# Altium schematic sheet Power.SchDoc
size 840 x 594 mm
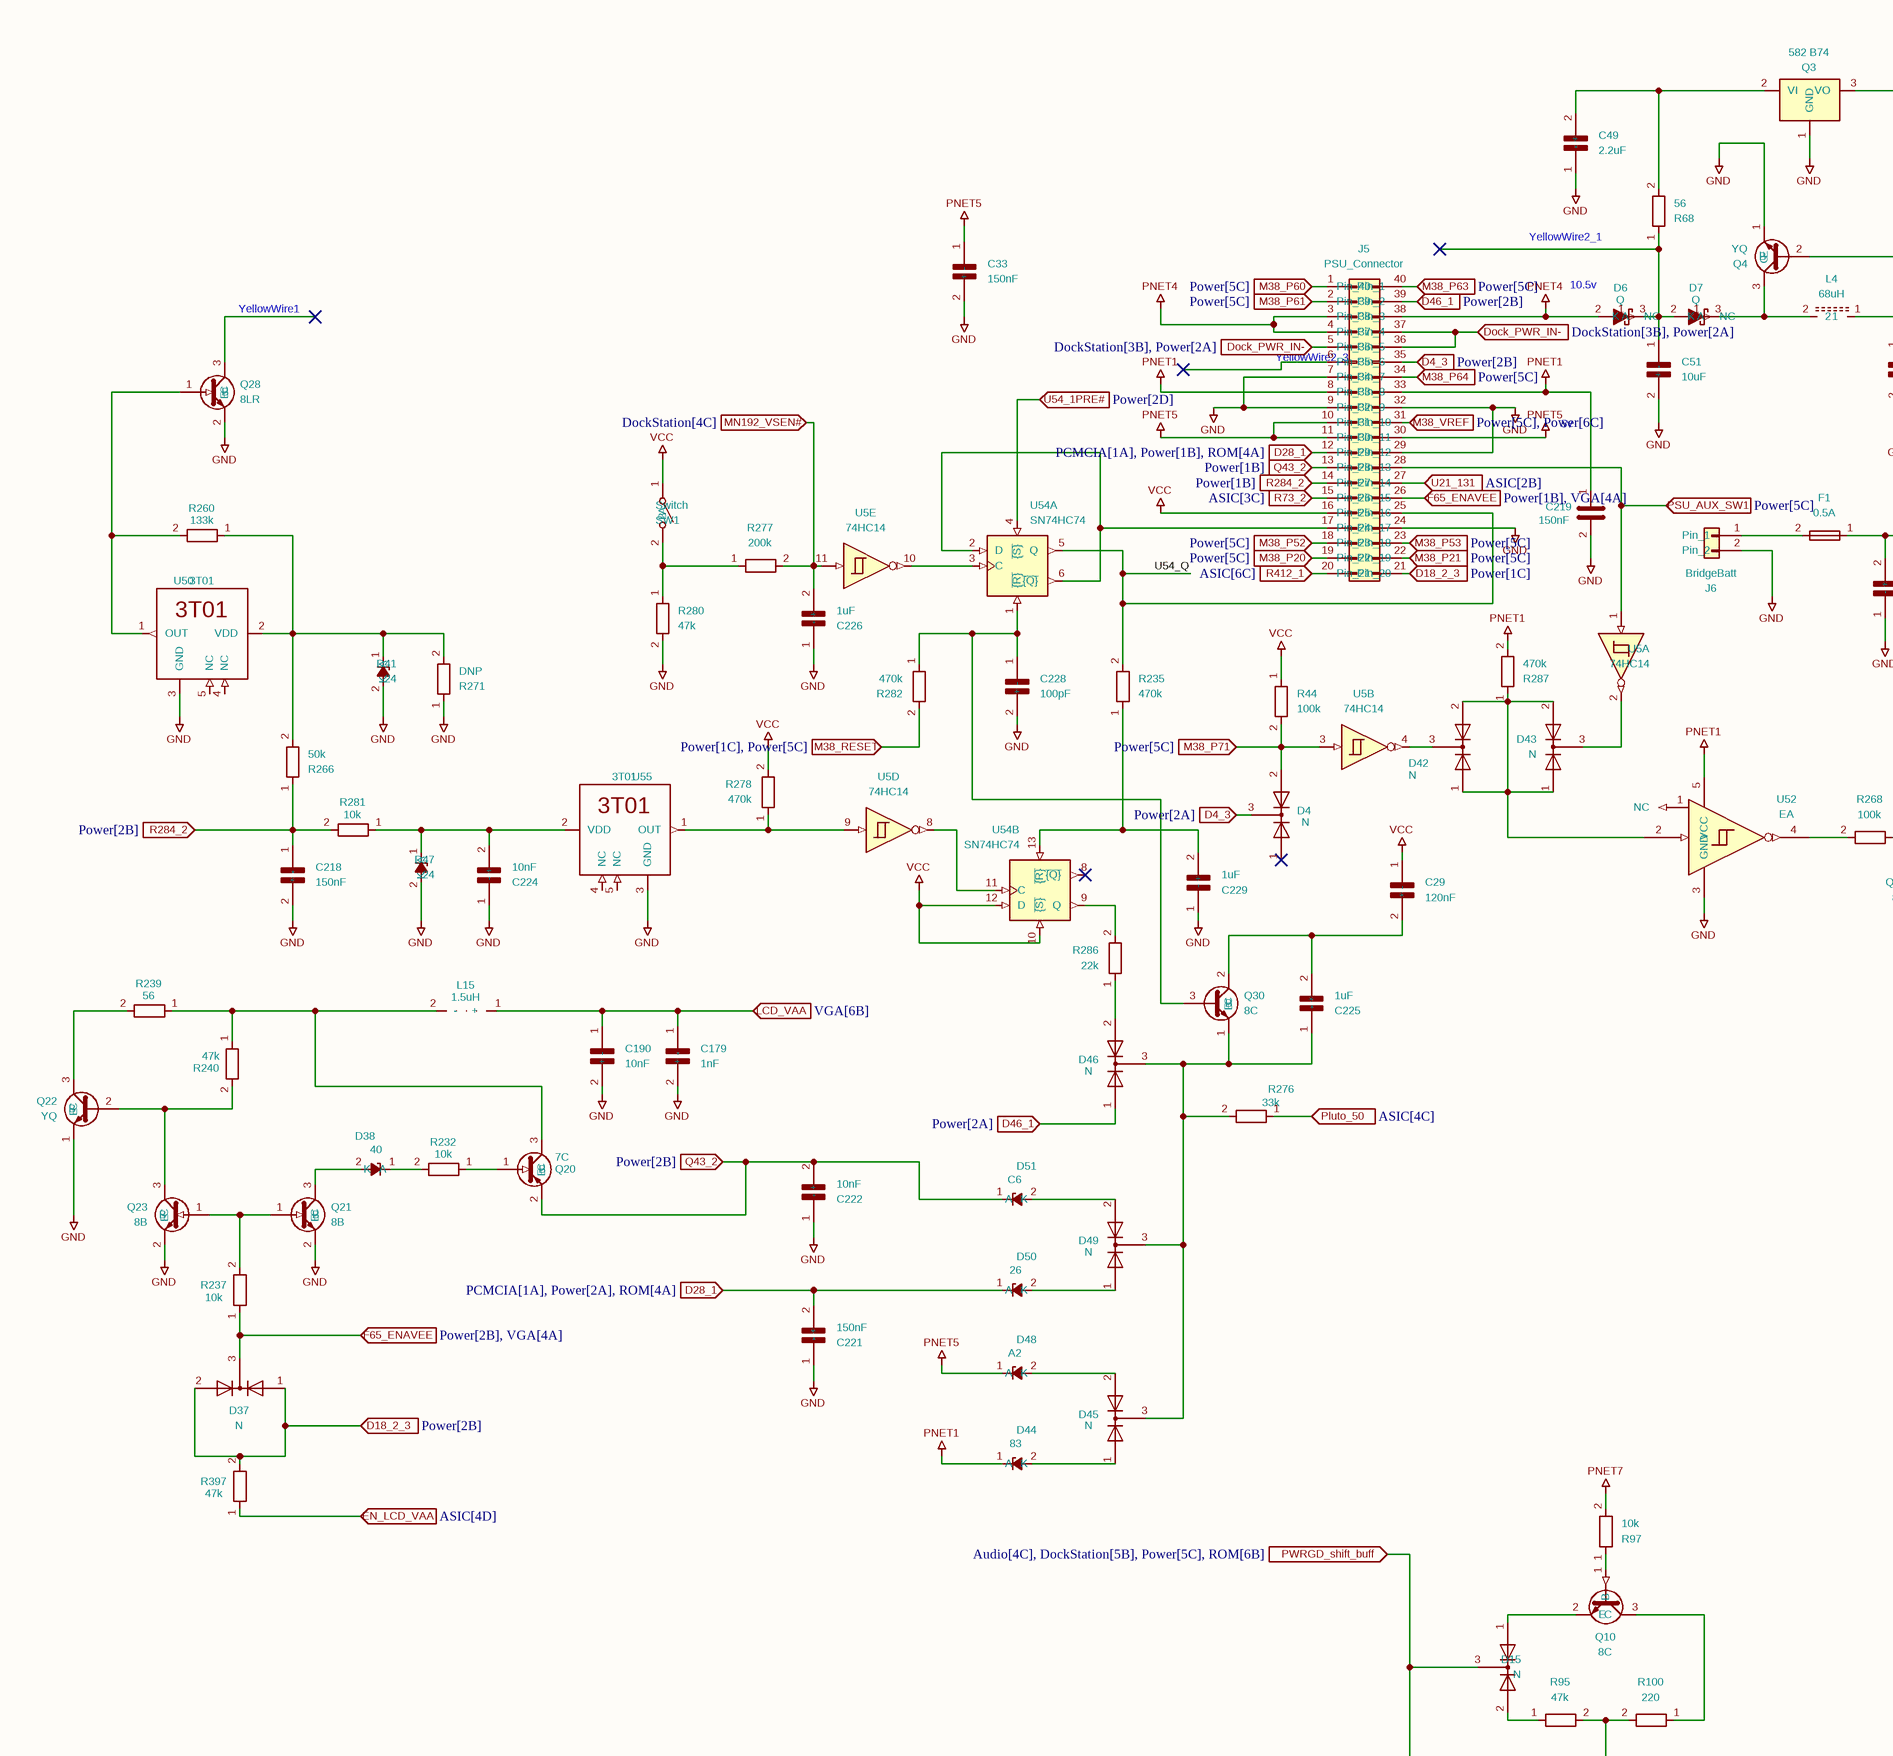
[diagram p0: Power.SchDoc, top left]
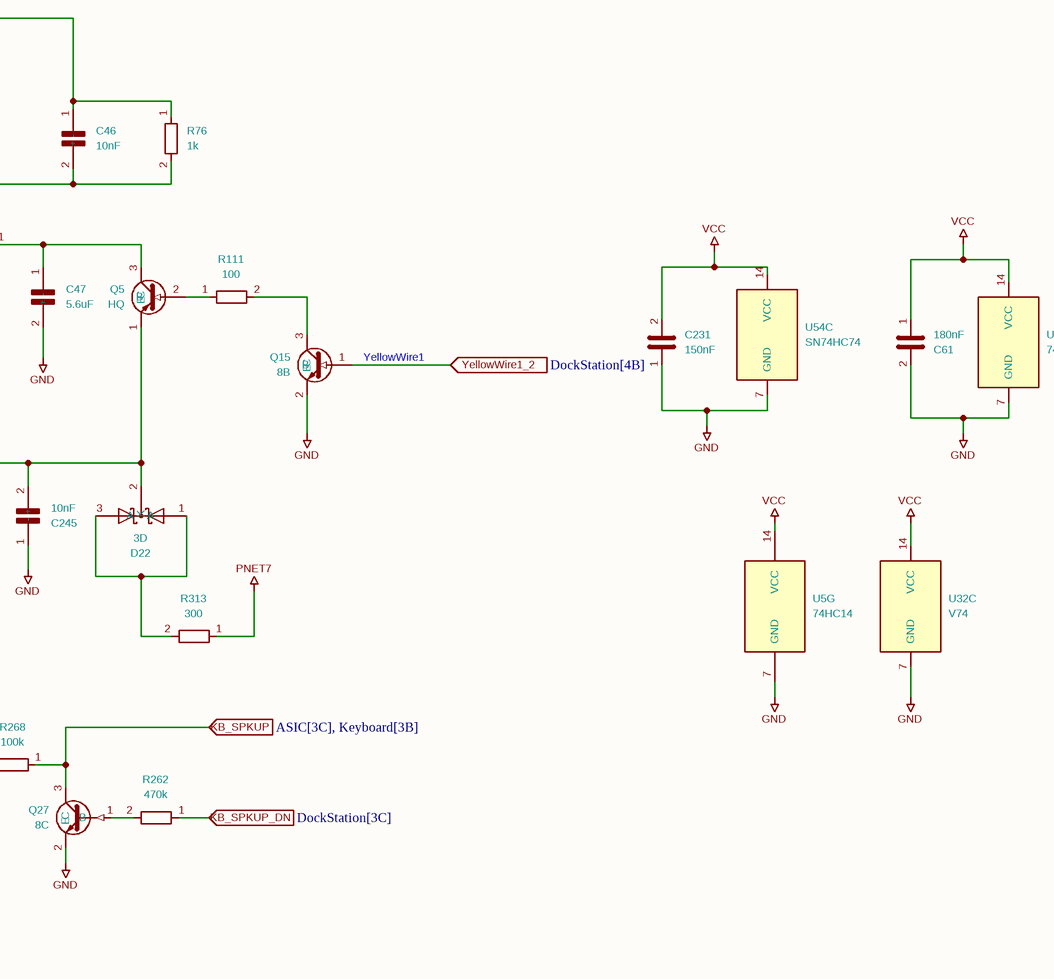
[diagram p1: Power.SchDoc, top middle]
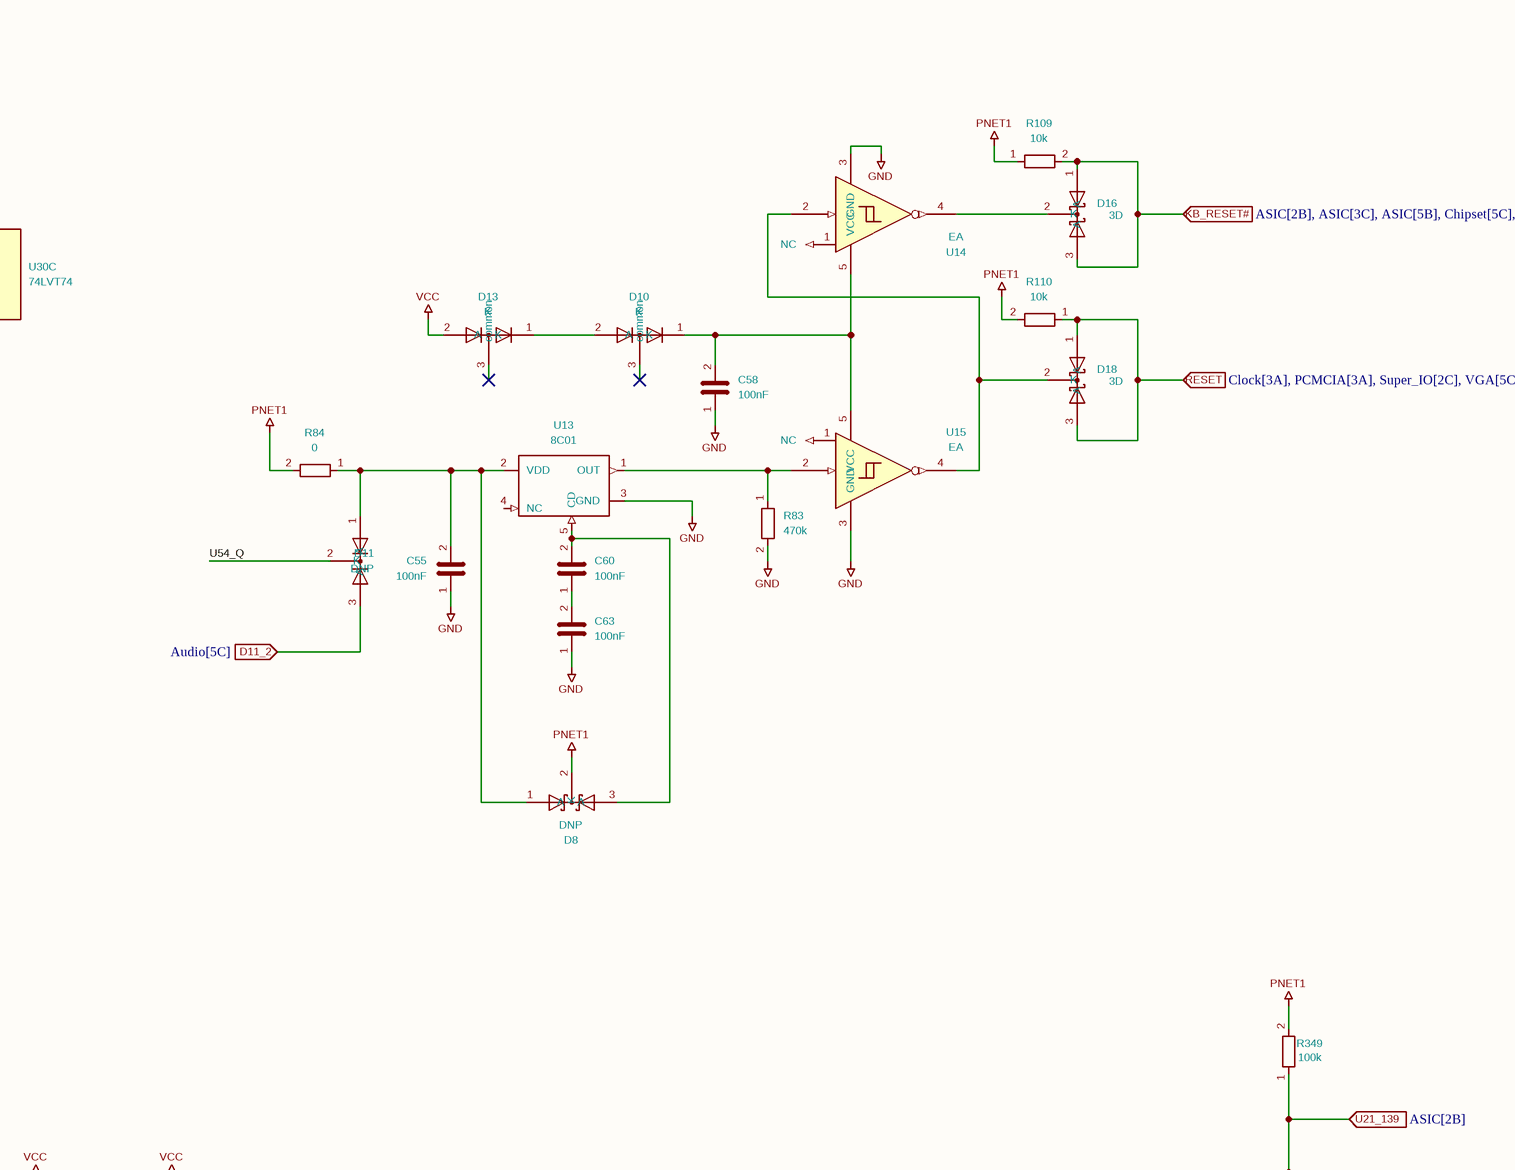
[diagram p2: Power.SchDoc, top right]
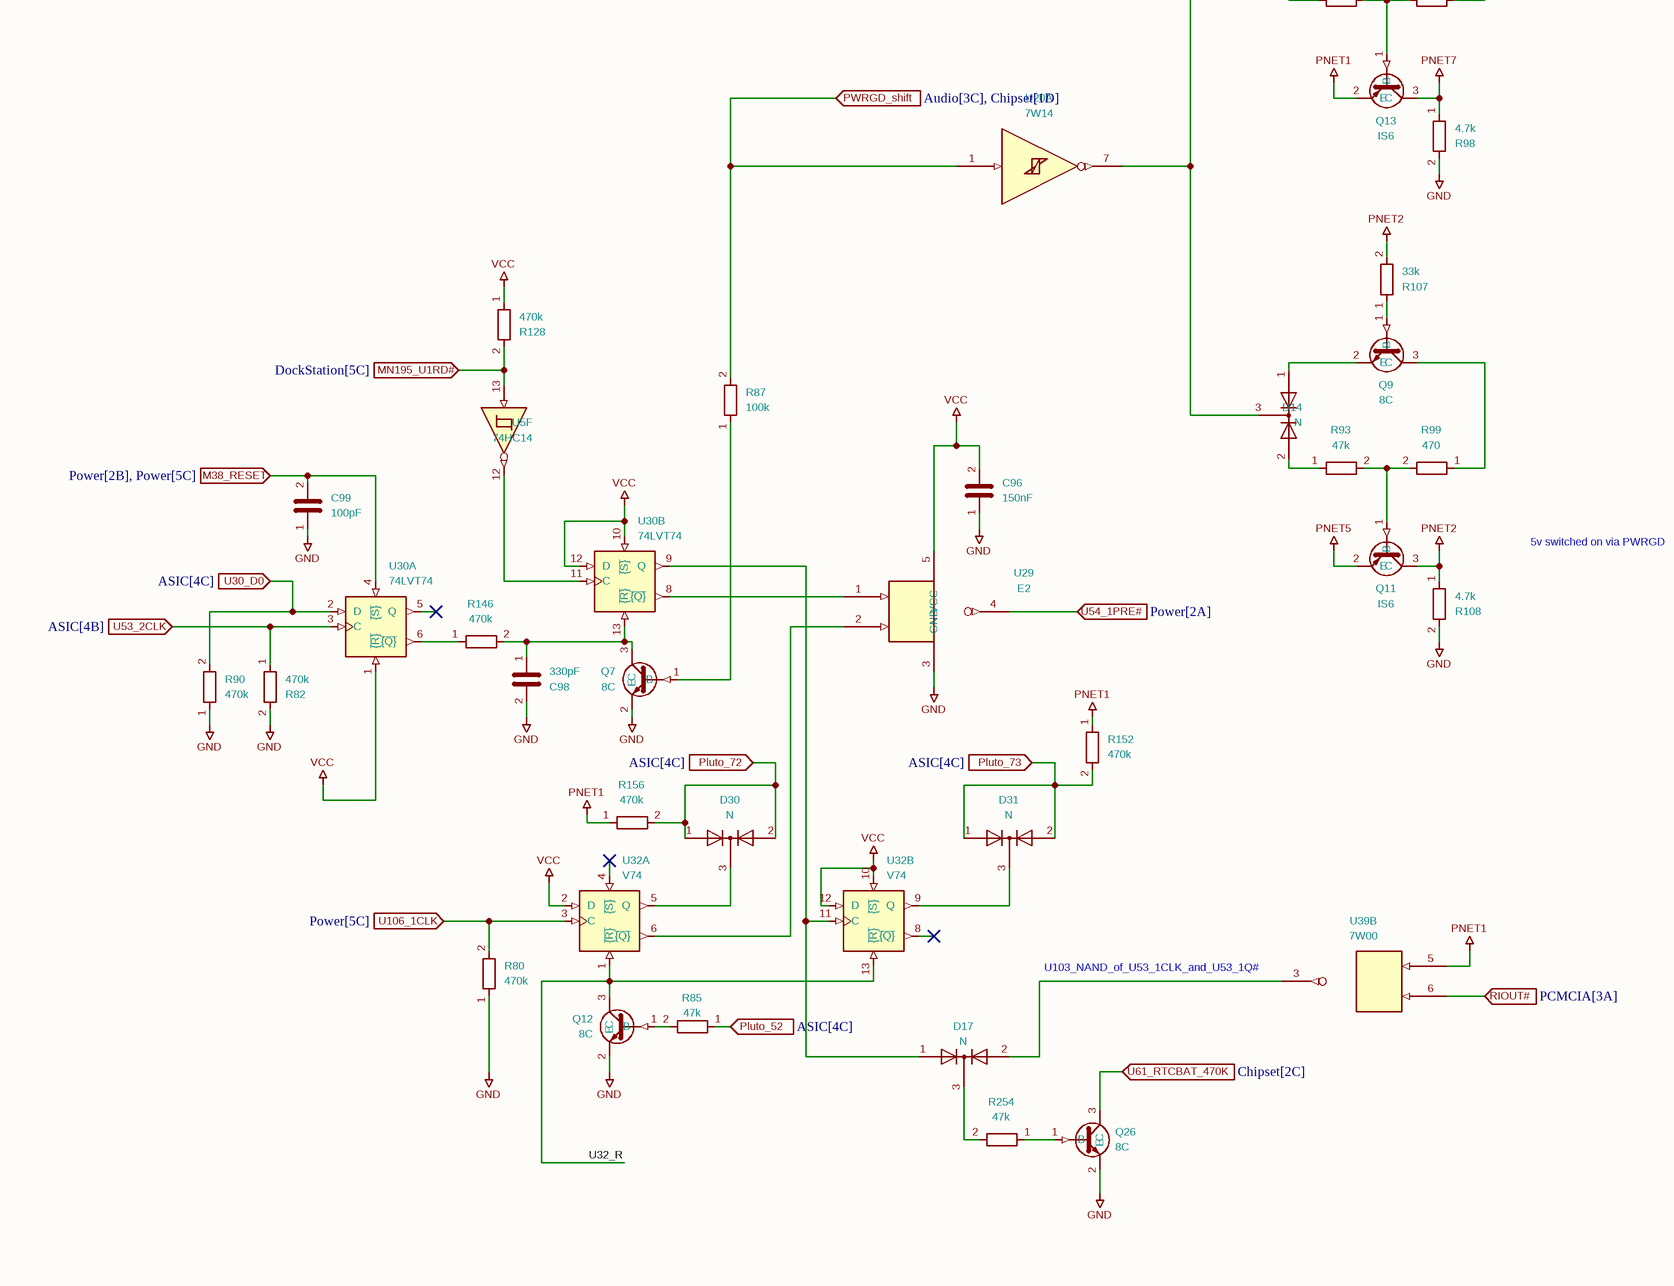
[diagram p3: Power.SchDoc, bottom left]
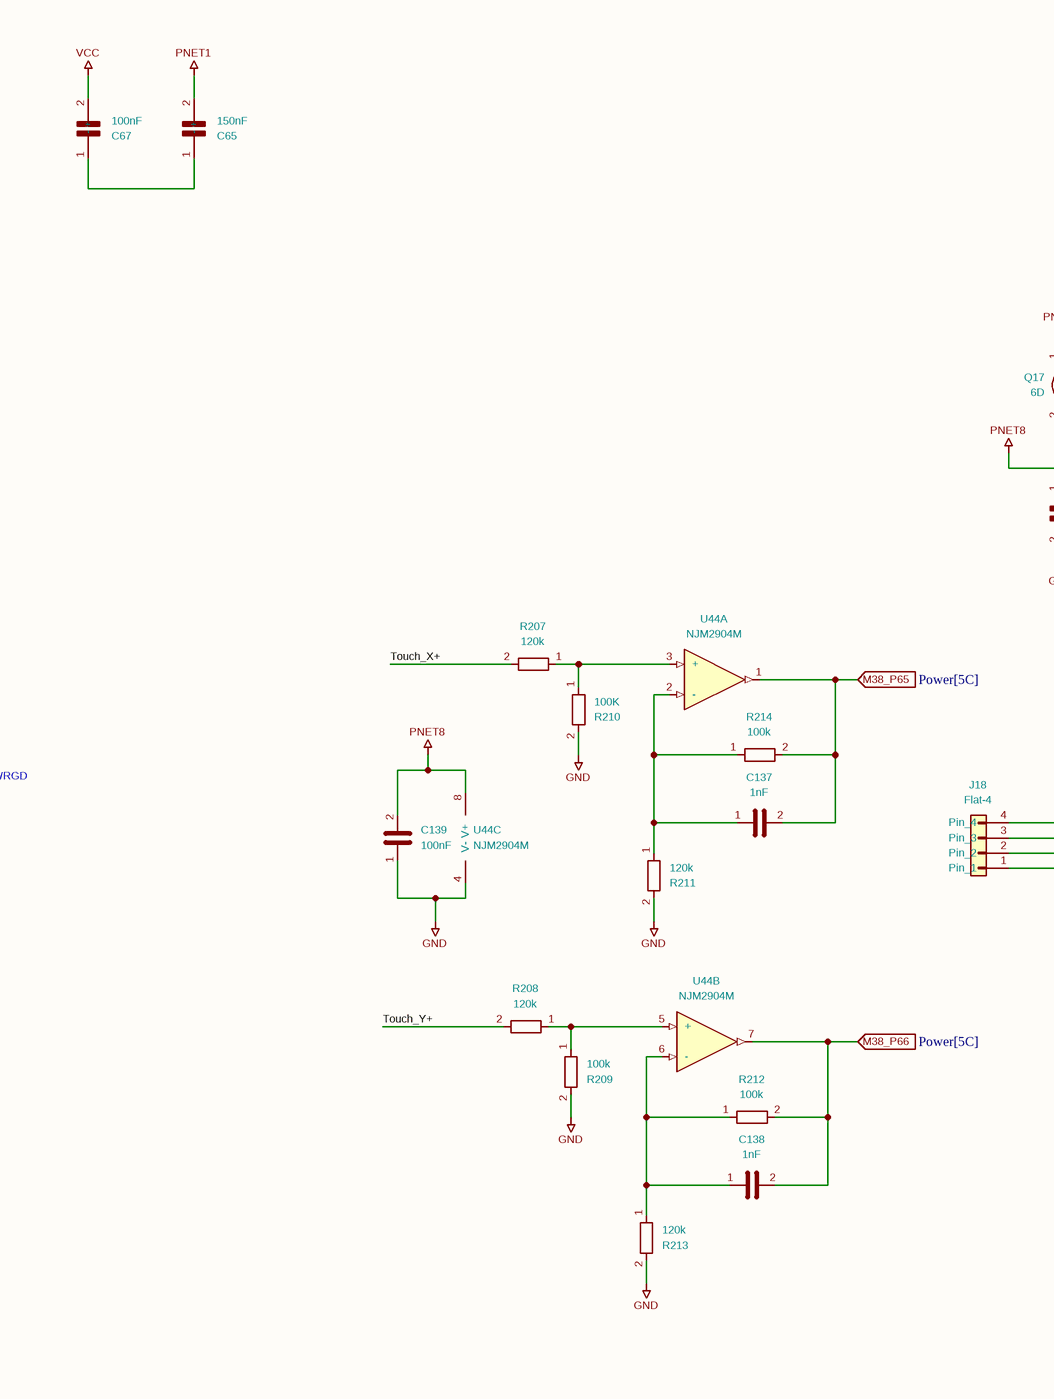
[diagram p4: Power.SchDoc, bottom middle]
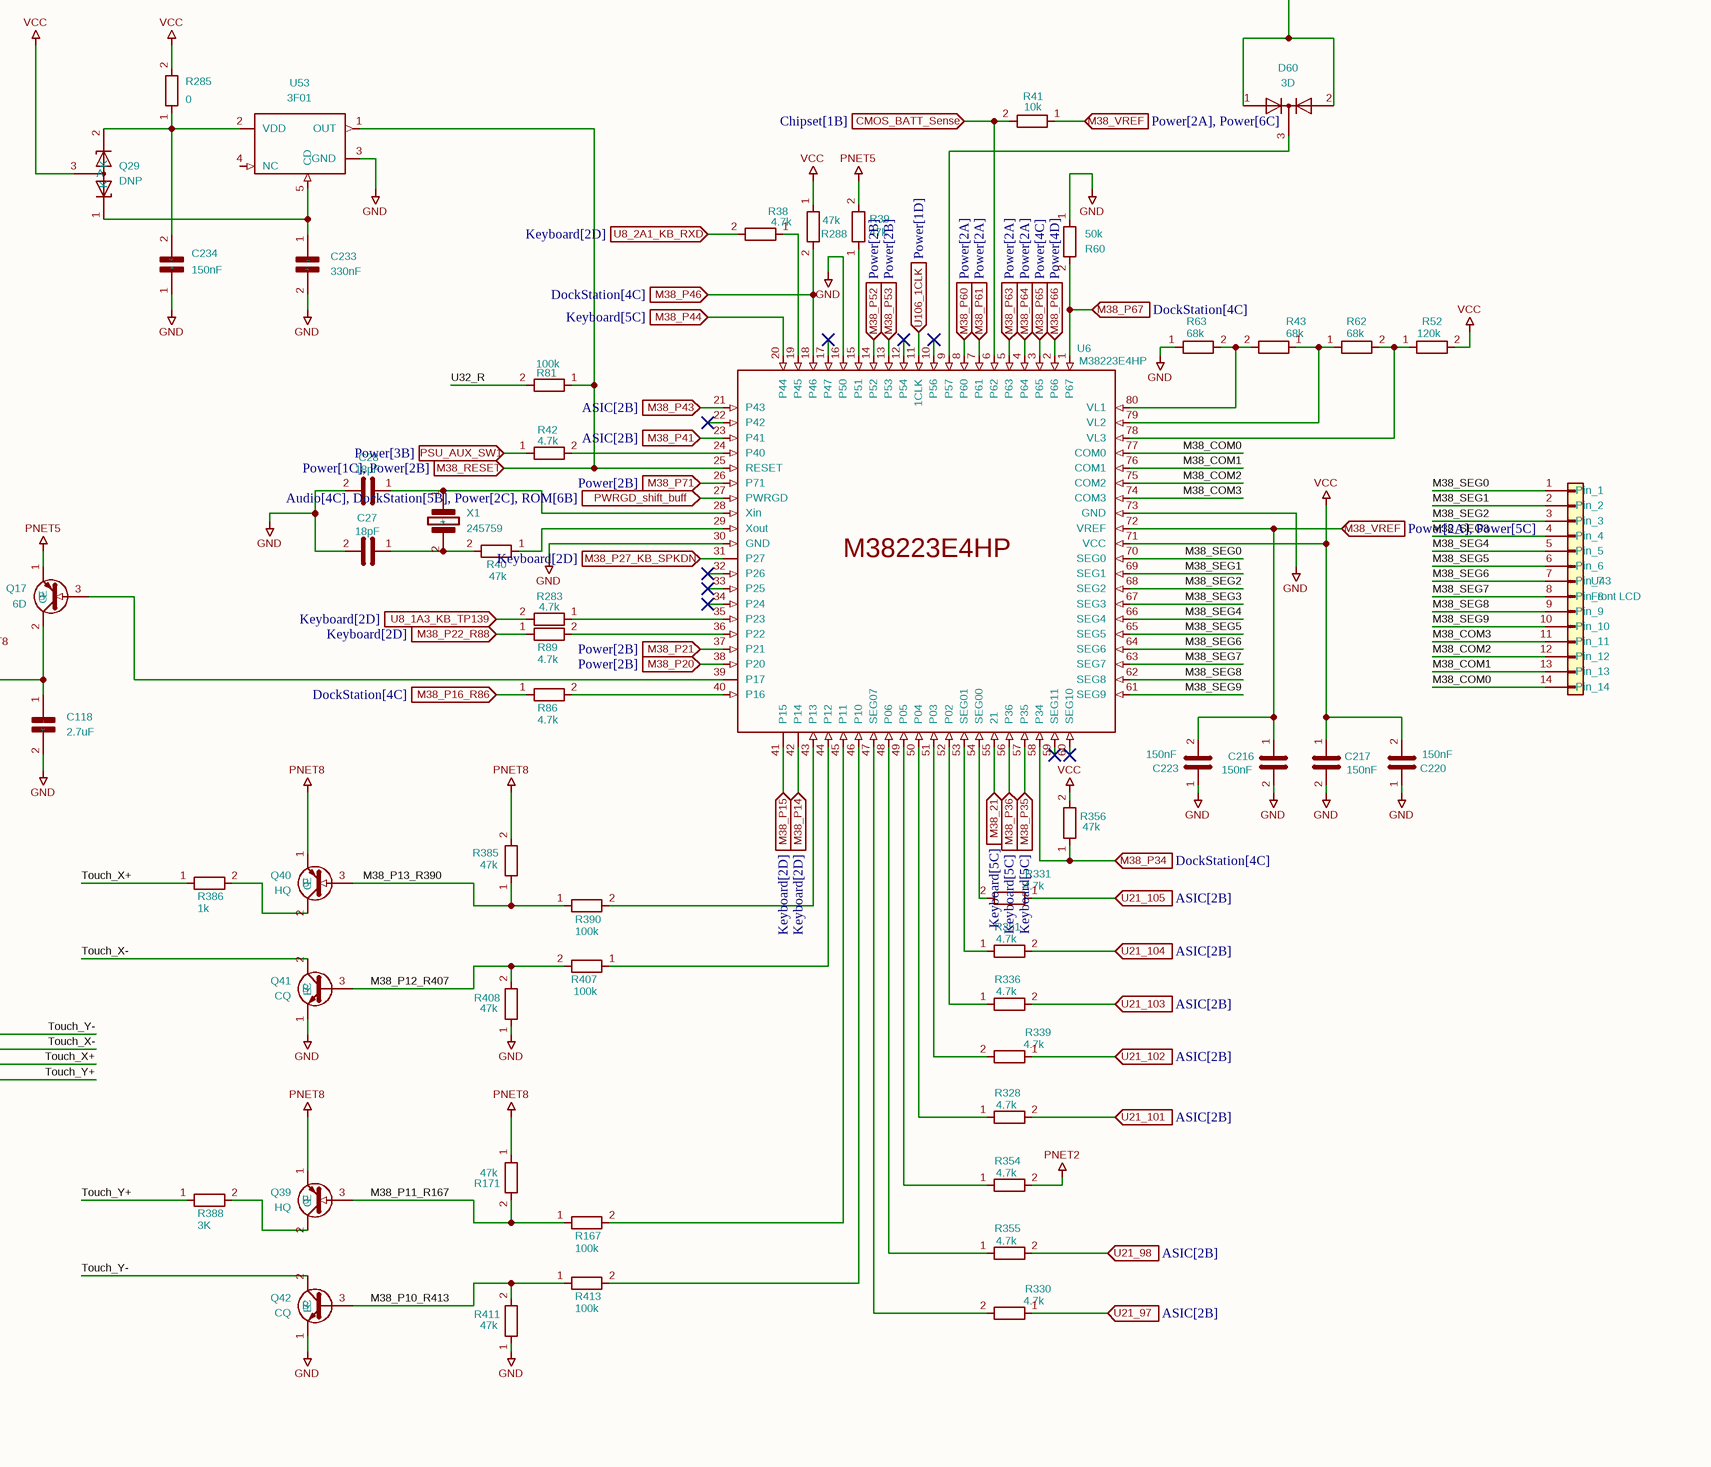
[diagram p5: Power.SchDoc, bottom right]

## Parts
C27  18pF  [C_0402_1005Metric]
C28  18pF  [C_0402_1005Metric]
C29  120nF  [C_0402_1005Metric]
C33  150nF  [C_0402_1005Metric]
C46  10nF  [C_0603_1608Metric]
C47  5.6uF  [C_1206_3216Metric]
C49  2.2uF  [C_0805_2012Metric]
C51  10uF  [C_1206_3216Metric]
C55  100nF  [C_0402_1005Metric]
C58  100nF  [C_0402_1005Metric]
C60  100nF  [C_0603_1608Metric]
C61  180nF  [C_0402_1005Metric]
C63  100nF  [C_0603_1608Metric]
C65  150nF  [C_0402_1005Metric]
C67  100nF  [C_0402_1005Metric]
C96  150nF  [C_0402_1005Metric]
C98  330pF  [C_0402_1005Metric]
C99  100pF  [C_0402_1005Metric]
C118  2.7uF  [C_0805_2012Metric]
C137  1nF  [C_0402_1005Metric]
C138  1nF  [C_0402_1005Metric]
C139  100nF  [C_0402_1005Metric]
C179  1nF  [C_0402_1005Metric]
C190  10nF  [C_0603_1608Metric]
C216  150nF  [C_0402_1005Metric]
C217  150nF  [C_0402_1005Metric]
C218  150nF  [C_0603_1608Metric]
C219  150nF  [C_0402_1005Metric]
C220  150nF  [C_0402_1005Metric]
C221  150nF  [C_0603_1608Metric]
C222  10nF  [C_0603_1608Metric]
C223  150nF  [C_0402_1005Metric]
C224  10nF  [C_0603_1608Metric]
C225  1uF  [C_0603_1608Metric]
C226  1uF  [C_0603_1608Metric]
C228  100pF  [C_0402_1005Metric]
C229  1uF  [C_0603_1608Metric]
C231  150nF  [C_0402_1005Metric]
C233  330nF  [C_0603_1608Metric]
C234  150nF  [C_0402_1005Metric]
C245  10nF  [C_0603_1608Metric]
D4  N  [SOT-416L]
D6  Q  [3D]
D7  Q  [3D]
D8  DNP  [3D]
D10  K  [SOT-416L]
D11  DNP  [3D]
D13  K  [SOT-416L]
D14  N  [SOT-416L]
D15  N  [SOT-416L]
D16  3D  [3D]
D17  N  [SOT-416L]
D18  3D  [3D]
D22  3D  [3D]
D30  N  [SOT-416L]
D31  N  [SOT-416L]
D37  N  [SOT-416L]
D38  40  [D_0603_1608Metric]
D41  24  [D_0603_1608Metric]
D42  N  [SOT-416L]
D43  N  [SOT-416L]
D44  83  [D_0603_1608Metric]
D45  N  [SOT-416L]
D46  N  [SOT-416L]
D47  24  [D_0603_1608Metric]
D48  A2  [D_0603_1608Metric]
D49  N  [SOT-416L]
D50  26  [D_0603_1608Metric]
D51  C6  [D_0603_1608Metric]
D60  3D  [SOT-23]
F1  0.5A  [Fuse_1206_3216Metric]
J5  PSU_Connector  [PSU_Connector]
J6  BridgeBatt  [BridgeBatt]
J18  Flat-4  [Flat-4]
L4  68uH  [L_1210_3225Metric]
L15  1.5uH  [L_0603_1608Metric]
Q3  582 B74  [SOT-89-3]
Q4  YQ  [SOT-416L]
Q5  HQ  [SOT-416L]
Q7  8C  [SOT-416]
Q9  8C  [SOT-523]
Q10  8C  [SOT-416]
Q11  IS6  [SOT-23]
Q12  8C  [SOT-416]
Q13  IS6  [SOT-23]
Q15  8B  [SOT-416]
Q17  6D  [3D]
Q20  7C  [TSOT-23]
Q21  8B  [SOT-416]
Q22  YQ  [SOT-416L]
Q23  8B  [SOT-416]
Q26  8C  [SOT-416]
Q27  8C  [SOT-416]
Q28  8LR  [SOT-416]
Q29  DNP  [SOT-23]
Q30  8C  [SOT-416]
Q39  HQ  [TSOT-23]
Q40  HQ  [TSOT-23]
Q41  CQ  [TSOT-23]
Q42  CQ  [TSOT-23]
R38  4.7k  [R_0402_1005Metric]
R39  47k  [R_0402_1005Metric]
R40  47k  [R_0402_1005Metric]
R41  10k  [R_0402_1005Metric]
R42  4.7k  [R_0402_1005Metric]
R43  68k  [R_0402_1005Metric]
R44  100k  [R_0402_1005Metric]
R52  120k  [R_0402_1005Metric]
R60  50k  [R_0402_1005Metric]
R62  68k  [R_0402_1005Metric]
R63  68k  [R_0402_1005Metric]
R68  56  [R_0805_2012Metric]
R76  1k  [R_0402_1005Metric]
R80  470k  [R_0402_1005Metric]
R81  100k  [R_0402_1005Metric]
R82  470k  [R_0402_1005Metric]
R83  470k  [R_0402_1005Metric]
R84  0  [R_0402_1005Metric]
R85  47k  [R_0402_1005Metric]
R86  4.7k  [R_0402_1005Metric]
R87  100k  [R_0402_1005Metric]
R89  4.7k  [R_0402_1005Metric]
R90  470k  [R_0402_1005Metric]
R93  47k  [R_0402_1005Metric]
R95  47k  [R_0402_1005Metric]
R97  10k  [R_0402_1005Metric]
R98  4.7k  [R_0402_1005Metric]
R99  470  [R_0402_1005Metric]
R100  220  [R_0402_1005Metric]
R107  33k  [R_0402_1005Metric]
R108  4.7k  [R_0402_1005Metric]
R109  10k  [R_0402_1005Metric]
R110  10k  [R_0402_1005Metric]
R111  100  [R_0603_1608Metric]
R128  470k  [R_0402_1005Metric]
R146  470k  [R_0402_1005Metric]
R152  470k  [R_0402_1005Metric]
R156  470k  [R_0402_1005Metric]
R167  100k  [R_0402_1005Metric]
R171  47k  [R_0402_1005Metric]
R207  120k  [R_0402_1005Metric]
R208  120k  [R_0402_1005Metric]
R209  100k  [R_0402_1005Metric]
R210  100K  [R_0402_1005Metric]
R211  120k  [R_0402_1005Metric]
R212  100k  [R_0402_1005Metric]
R213  120k  [R_0402_1005Metric]
R214  100k  [R_0402_1005Metric]
R232  10k  [R_0402_1005Metric]
R235  470k  [R_0402_1005Metric]
R237  10k  [R_0402_1005Metric]
R239  56  [R_0603_1608Metric]
R240  47k  [R_0402_1005Metric]
R254  47k  [R_0402_1005Metric]
R260  133k  [R_0402_1005Metric]
R262  470k  [R_0402_1005Metric]
R266  50k  [R_0402_1005Metric]
R268  100k  [R_0402_1005Metric]
R271  DNP  [R_0402_1005Metric]
R276  33k  [R_0402_1005Metric]
R277  200k  [R_0402_1005Metric]
R278  470k  [R_0402_1005Metric]
R280  47k  [R_0402_1005Metric]
R281  10k  [R_0402_1005Metric]
R282  470k  [R_0402_1005Metric]
R283  4.7k  [R_0402_1005Metric]
R285  0  [R_0402_1005Metric]
R286  22k  [R_0402_1005Metric]
R287  470k  [R_0402_1005Metric]
R288  47k  [R_0402_1005Metric]
R313  300  [R_0805_2012Metric]
R328  4.7k  [R_0402_1005Metric]
R330  4.7k  [R_0402_1005Metric]
R331  4.7k  [R_0402_1005Metric]
R336  4.7k  [R_0402_1005Metric]
R339  4.7k  [R_0402_1005Metric]
R349  100k  [R_0402_1005Metric]
R351  4.7k  [R_0402_1005Metric]
R354  4.7k  [R_0402_1005Metric]
R355  4.7k  [R_0402_1005Metric]
R356  47k  [R_0402_1005Metric]
R385  47k  [R_0402_1005Metric]
R386  1k  [R_0402_1005Metric]
R388  3K  [R_0402_1005Metric]
R390  100k  [R_0402_1005Metric]
R397  47k  [R_0402_1005Metric]
R407  100k  [R_0402_1005Metric]
R408  47k  [R_0402_1005Metric]
R411  47k  [R_0402_1005Metric]
R413  100k  [R_0402_1005Metric]
SW1  Switch  [Switch]
U5  74HC14  [TSSOP-14_4.4x5mm_P0.65mm]  (parts A,B,D,E,F,G of 7)
U6  M38223E4HP  [QFN-80]
U13  8C01  [SOT-23-5]
U14  EA  [SOT-353]
U15  EA  [SOT-353]
U20  7W14  [sso-8]  (part A of 4)
U29  E2  [SOT-353]
U30  74LVT74  [TSSOP-14_4.4x5mm_P0.65mm]  (parts A,B,C of 3)
U32  V74  [TSSOP-14_4.4x5mm_P0.65mm]  (parts A,B,C of 3)
U39  7W00  [sso-8]  (part B of 3)
U43  Front LCD  [LCD]
U44  NJM2904M  [soic-8-small]  (parts A,B,C of 3)
U50  3T01  [SOT-23-5]
U52  EA  [SOT-353]
U53  3F01  [TSOP-5_1.65x3.05mm_P0.95mm]
U54  SN74HC74  [TSSOP-14_4.4x5mm_P0.65mm]  (parts A,B,C of 3)
U55  3T01  [TSOP-5_1.65x3.05mm_P0.95mm]
X1  245759  [XTAL-2]

## Ports
CMOS_BATT_Sense (in, see Chipset[1B]), D4_3 (in, see Power[2A]), D4_3 (in, see Power[2B]), D11_2 (in, see Audio[5C]), D18_2_3 (in, see Power[1C]), D18_2_3 (in, see Power[2B]), D28_1 (in, see PCMCIA[1A], Power[1B], ROM[4A]), D28_1 (in, see PCMCIA[1A], Power[2A], ROM[4A]), D46_1 (in, see Power[2A]), D46_1 (in, see Power[2B]), Dock_PWR_IN- (in, see DockStation[3B], Power[2A]), EN_LCD_VAA (in, see ASIC[4D]), F65_ENAVEE (in, see Power[1B], VGA[4A]), F65_ENAVEE (in, see Power[2B], VGA[4A]), KB_RESET# (in, see ASIC[2B], ASIC[3C], ASIC[5B], Chipset[5C], Keyboard[3B]), KB_SPKUP (in, see ASIC[3C], Keyboard[3B]), KB_SPKUP_DN (in, see DockStation[3C]), LCD_VAA (in, see VGA[6B]), M38_21 (in, see Keyboard[5C]), M38_P14 (in, see Keyboard[2D]), M38_P15 (in, see Keyboard[2D]), M38_P16_R86 (in, see DockStation[4C]), M38_P20 (in, see Power[2B]), M38_P20 (in, see Power[5C]), M38_P21 (in, see Power[2B]), M38_P21 (in, see Power[5C]), M38_P22_R88 (in, see Keyboard[2D]), M38_P27_KB_SPKDN (in, see Keyboard[2D]), M38_P34 (in, see DockStation[4C]), M38_P35 (in, see Keyboard[5C]), M38_P36 (in, see Keyboard[5C]), M38_P41 (in, see ASIC[2B]), M38_P43 (in, see ASIC[2B]), M38_P44 (in, see Keyboard[5C]), M38_P46 (in, see DockStation[4C]), M38_P52 (in, see Power[2B]), M38_P52 (in, see Power[5C]), M38_P53 (in, see Power[2B]), M38_P53 (in, see Power[5C]), M38_P60 (in, see Power[2A]), M38_P60 (in, see Power[5C]), M38_P61 (in, see Power[2A]), M38_P61 (in, see Power[5C]), M38_P63 (in, see Power[2A]), M38_P63 (in, see Power[5C]), M38_P64 (in, see Power[2A]), M38_P64 (in, see Power[5C]), M38_P65 (in, see Power[4C]), M38_P65 (in, see Power[5C]), M38_P66 (in, see Power[4D]), M38_P66 (in, see Power[5C]), M38_P67 (in, see DockStation[4C]), M38_P71 (in, see Power[2B]), M38_P71 (in, see Power[5C]), M38_RESET (in, see Power[1C], Power[2B]), M38_RESET (in, see Power[1C], Power[5C]), M38_RESET (in, see Power[2B], Power[5C]), M38_VREF (in, see Power[2A], Power[5C]), M38_VREF (in, see Power[2A], Power[6C]), M38_VREF (in, see Power[5C], Power[6C]), MN192_VSEN# (in, see DockStation[4C]), MN195_U1RD# (in, see DockStation[5C]), Pluto_50 (in, see ASIC[4C]), Pluto_52 (in, see ASIC[4C]), Pluto_72 (in, see ASIC[4C]), Pluto_73 (in, see ASIC[4C]), PSU_AUX_SW1 (in, see Power[3B]), PSU_AUX_SW1 (in, see Power[5C]), PWRGD_shift (in, see Audio[3C], Chipset[1D]), PWRGD_shift_buff (in, see Audio[4C], DockStation[5B], Power[2C], ROM[6B]), PWRGD_shift_buff (in, see Audio[4C], DockStation[5B], Power[5C], ROM[6B]), Q43_2 (in, see Power[1B]), Q43_2 (in, see Power[2B]), R73_2 (in, see ASIC[3C]), R284_2 (in, see Power[1B]), R284_2 (in, see Power[2B]), R412_1 (in, see ASIC[6C]), RESET (in, see Clock[3A], PCMCIA[3A], Super_IO[2C], VGA[5C]), RIOUT# (in, see PCMCIA[3A]), U8_1A3_KB_TP139 (in, see Keyboard[2D]), U8_2A1_KB_RXD (in, see Keyboard[2D]), U21_97 (in, see ASIC[2B]), U21_98 (in, see ASIC[2B]), U21_101 (in, see ASIC[2B]), U21_102 (in, see ASIC[2B]), U21_103 (in, see ASIC[2B]), U21_104 (in, see ASIC[2B]), U21_105 (in, see ASIC[2B]), U21_131 (in, see ASIC[2B]), U21_139 (in, see ASIC[2B]), U30_D0 (in, see ASIC[4C]), U53_2CLK (in, see ASIC[4B]), U54_1PRE# (in, see Power[2A]), U54_1PRE# (in, see Power[2D]), U61_RTCBAT_470K (in, see Chipset[2C]), U106_1CLK (in, see Power[1D]), U106_1CLK (in, see Power[5C]), YellowWire1_2 (in, see DockStation[4B])

## Nets
GND: C27.2 C28.2 C33.2(-) C47.2(-) C49.1(+) C51.2(-) C55.1 C58.1 C61.2 C63.1 C96.1 C98.2 C99.1 C118.2(-) C139.1 C179.2(-) C190.2(-) C216.2 C217.2 C218.2(-) C219.2 C220.1 C221.1(+) C222.1(+) C223.1 C224.1(+) C226.1(+) C228.2(-) C229.1(+) C231.1 C233.2(-) C234.1(+) C245.1(+) D41.2(A) D47.2(A) J5.7(Pin_7) J5.9(Pin_9) J5.24(Pin_24) J5.29(Pin_29) J5.32(Pin_32) J6.2(Pin_2) Q3.1(GND) Q4.1(E) Q7.2(E) Q12.2(E) Q15.2(E) Q21.2(E) Q22.1(E) Q23.2(E) Q26.2(E) Q27.2(E) Q28.2(E) Q41.1(E) Q42.1(E) R60.1 R63.1 R80.1 R82.2 R83.2 R90.1 R98.2 R108.2 R209.2 R210.2 R211.2 R213.2 R271.1 R280.2 R408.1 R411.1 U5.7(GND) U6.16(P50) U6.30(GND) U6.73(GND) U13.3(GND) U14.3(GND) U15.3(GND) U29.3(GND) U30.7(GND) U32.7(GND) U44.4(V-) U50.3(GND) U52.3(GND) U53.3(GND) U54.7(GND) U55.3(GND)
PNET1: C65.2(-) C219.1 D8.2(K) D44.1(K) J5.8(Pin_8) J5.33(Pin_33) Q13.2(E) R84.2 R109.1 R110.2 R152.1 R156.1 R287.2 R349.2 U39.5 U52.5(VCC)
PNET2: Q11.3(C) R107.2 R108.1 R354.2
PNET4: D6.2(A) J5.3(Pin_3) J5.4(Pin_4) J5.38(Pin_38)
PNET5: C33.1(+) D48.1(K) J5.10(Pin_10) J5.11(Pin_11) J5.30(Pin_30) Q11.2(E) Q17.1(E) R39.2
PNET7: Q13.3(C) R97.2 R98.1 R313.1
PNET8: C118.1(+) C139.2 Q17.2(C) Q39.1(E) Q40.1(E) R171.1 R385.2 U44.8(V+)
VCC: C29.1(+) C61.1 C67.2(-) C96.2 C217.1 C220.2 C231.2 D13.2(A) J5.16(Pin_16) Q29.3(A) R44.1 R52.2 R128.1 R278.2 R285.2 R288.1 R356.2 SW1.1(A) U5.14(VCC) U6.71(VCC) U29.5(VCC) U30.1(~{{R}}) U30.10(~{{S}}) U30.12(D) U30.14(VCC) U32.2(D) U32.10(~{{S}}) U32.12(D) U32.14(VCC) U54.10(~{{S}}) U54.12(D) U54.14(VCC)
CMOS_BATT_Sense: R41.2 U6.6(P62) ; port CMOS_BATT_Sense
D4_3: D4.3 J5.35(Pin_35) ; port D4_3
D11_2: D11.3(A) ; port D11_2
D18_2_3: D37.1 D37.2 J5.21(Pin_21) R397.2 ; port D18_2_3
D28_1: C221.2(-) D50.1(K) J5.12(Pin_12) ; port D28_1
D46_1: D46.1 J5.39(Pin_39) ; port D46_1
Dock_PWR_IN-: J5.5(Pin_5) J5.36(Pin_36) J5.37(Pin_37) ; port Dock_PWR_IN-
EN_LCD_VAA: R397.1 ; port EN_LCD_VAA
F65_ENAVEE: D37.3 J5.26(Pin_26) R237.1 ; port F65_ENAVEE
KB_RESET#: D16.1(A) D16.3(A) R109.2 ; port KB_RESET#
KB_SPKUP: Q27.3(C) R268.1 ; port KB_SPKUP
KB_SPKUP_DN: R262.1 ; port KB_SPKUP_DN
LCD_VAA: C179.1(+) C190.1(+) L15.1(+) ; port LCD_VAA
M38_21: U6.55(21) ; port M38_21
M38_COM0: U6.77(COM0) U43.14(Pin_14)
M38_COM1: U6.76(COM1) U43.13(Pin_13)
M38_COM2: U6.75(COM2) U43.12(Pin_12)
M38_COM3: U6.74(COM3) U43.11(Pin_11)
M38_P10_R413: Q42.3(B) R411.2 R413.1
M38_P11_R167: Q39.3(B) R167.1 R171.2
M38_P12_R407: Q41.3(B) R407.2 R408.2
M38_P13_R390: Q40.3(B) R385.1 R390.1
M38_P14: U6.42(P14) ; port M38_P14
M38_P15: U6.41(P15) ; port M38_P15
M38_P16_R86: R86.1 ; port M38_P16_R86
M38_P20: J5.19(Pin_19) U6.38(P20) ; port M38_P20
M38_P21: J5.22(Pin_22) U6.37(P21) ; port M38_P21
M38_P22_R88: R89.1 ; port M38_P22_R88
M38_P27_KB_SPKDN: U6.31(P27) ; port M38_P27_KB_SPKDN
M38_P34: R356.1 U6.58(P34) ; port M38_P34
M38_P35: U6.57(P35) ; port M38_P35
M38_P36: U6.56(P36) ; port M38_P36
M38_P41: U6.23(P41) ; port M38_P41
M38_P43: U6.21(P43) ; port M38_P43
M38_P44: U6.20(P44) ; port M38_P44
M38_P46: R288.2 U6.18(P46) ; port M38_P46
M38_P52: J5.18(Pin_18) U6.14(P52) ; port M38_P52
M38_P53: J5.23(Pin_23) U6.13(P53) ; port M38_P53
M38_P60: J5.1(Pin_1) U6.8(P60) ; port M38_P60
M38_P61: J5.2(Pin_2) U6.7(P61) ; port M38_P61
M38_P63: J5.40(Pin_40) U6.5(P63) ; port M38_P63
M38_P64: J5.34(Pin_34) U6.4(P64) ; port M38_P64
M38_P65: C137.2 R214.2 U6.3(P65) U44.1 ; port M38_P65
M38_P66: C138.2 R212.2 U6.2(P66) U44.7 ; port M38_P66
M38_P67: R60.2 U6.1(P67) ; port M38_P67
M38_P71: D4.2 R44.2 U5.3 U6.26(P71) ; port M38_P71
M38_RESET: C99.2 R81.1 R282.2 U6.25(RESET) U30.4(~{{S}}) U53.1(OUT) ; port M38_RESET
M38_SEG0: U6.70(SEG0) U43.1(Pin_1)
M38_SEG1: U6.69(SEG1) U43.2(Pin_2)
M38_SEG2: U6.68(SEG2) U43.3(Pin_3)
M38_SEG3: U6.67(SEG3) U43.4(Pin_4)
M38_SEG4: U6.66(SEG4) U43.5(Pin_5)
M38_SEG5: U6.65(SEG5) U43.6(Pin_6)
M38_SEG6: U6.64(SEG6) U43.7(Pin_7)
M38_SEG7: U6.63(SEG7) U43.8(Pin_8)
M38_SEG8: U6.62(SEG8) U43.9(Pin_9)
M38_SEG9: U6.61(SEG9) U43.10(Pin_10)
M38_VREF: C216.1 C223.2 J5.31(Pin_31) R41.1 U6.72(VREF) ; port M38_VREF
MN192_VSEN#: C226.2(-) R277.2 U5.11 ; port MN192_VSEN#
MN195_U1RD#: R128.2 U5.13 ; port MN195_U1RD#
Pluto_50: R276.1 ; port Pluto_50
Pluto_52: R85.1 ; port Pluto_52
Pluto_72: D30.1 D30.2 R156.2 ; port Pluto_72
Pluto_73: D31.1 D31.2 R152.2 ; port Pluto_73
PSU_AUX_SW1: J5.28(Pin_28) R42.1 U5.1 ; port PSU_AUX_SW1
PWRGD_shift: R87.2 U20.1 ; port PWRGD_shift
PWRGD_shift_buff: D14.3 D15.3 U6.27(PWRGD) U20.7 ; port PWRGD_shift_buff
Q43_2: C222.2(-) D51.1(K) J5.13(Pin_13) Q20.2(E) ; port Q43_2
R73_2: J5.15(Pin_15) ; port R73_2
R284_2: C218.1(+) J5.14(Pin_14) R266.1 R281.2 ; port R284_2
R412_1: J5.20(Pin_20) ; port R412_1
RESET: D18.1(A) D18.3(A) R110.1 ; port RESET
RIOUT#: U39.6 ; port RIOUT#
Touch_X+: J18.2(Pin_2) R207.2 R386.1
Touch_X-: J18.3(Pin_3) Q41.2(C)
Touch_Y+: J18.1(Pin_1) R208.2 R388.1
Touch_Y-: J18.4(Pin_4) Q42.2(C)
U8_1A3_KB_TP139: R283.2 ; port U8_1A3_KB_TP139
U8_2A1_KB_RXD: R38.2 ; port U8_2A1_KB_RXD
U21_97: R330.1 ; port U21_97
U21_98: R355.2 ; port U21_98
U21_101: R328.2 ; port U21_101
U21_102: R339.1 ; port U21_102
U21_103: R336.2 ; port U21_103
U21_104: R351.2 ; port U21_104
U21_105: R331.1 ; port U21_105
U21_131: J5.27(Pin_27) ; port U21_131
U21_139: D60.1 D60.2 R349.1 ; port U21_139
U30_D0: R90.2 U30.2(D) ; port U30_D0
U32_R: Q12.3(C) R81.2 U32.1(~{{R}}) U32.13(~{{R}})
U53_2CLK: R82.1 U30.3(C) ; port U53_2CLK
U54_1PRE#: U29.4 U54.4(~{{S}}) ; port U54_1PRE#
U54_Q: D11.2(K) J5.25(Pin_25) R235.2 U54.5(Q)
U61_RTCBAT_470K: Q26.3(C) ; port U61_RTCBAT_470K
U106_1CLK: R80.2 U6.11(1CLK) U32.3(C) ; port U106_1CLK
YellowWire1_2: Q15.1(B) ; port YellowWire1_2
NetC27_1: C27.1 R40.2 X1.2(-)
NetC28_1: C28.1 U6.28(Xin) X1.1(+)
NetC29_2: C29.2(-) C225.2(-) Q30.2(C)
NetC46_1: C46.1(+) Q3.3(VO) R76.1
NetC46_2: C46.2(-) Q4.2(B) R76.2
NetC47_1: C47.1(+) L4.1 Q5.3(C)
NetC49_2: C49.2(-) Q3.2(VI) R68.2
NetC51_1: C51.1(+) D6.3(K) D7.2(A) R68.1
NetC55_2: C55.2 D8.1(A) D11.1(A) R84.1 U13.2(VDD)
NetC58_2: C58.2 D10.1(K) U14.5(VCC) U15.5(VCC)
NetC60_1: C60.1 C63.2
NetC60_2: C60.2 D8.3(A) U13.5(CD)
NetC65_1: C65.1(+) C67.1(+)
NetC98_1: C98.1 Q7.3(C) R146.2 U30.13(~{{R}})
NetC137_1: C137.1 R211.1 R214.1 U44.2(-)
NetC138_1: C138.1 R212.1 R213.1 U44.6(-)
NetC224_2: C224.2(-) D47.1(K) R281.1 U55.2(VDD)
NetC225_1: C225.1(+) D45.3 D46.3 D49.3 Q30.1(E) R276.2
NetC228_1: C228.1(+) Q30.3(B) R282.1 U54.1(~{{R}})
NetC229_2: C229.2(-) R235.1 U54.13(~{{R}})
NetC233_1: C233.1(+) Q29.1(K) U53.5(CD)
NetC234_2: C234.2(-) Q29.2(K) R285.1 U53.2(VDD)
NetC245_2: C245.2(-) D22.2(K) F1.1 Q5.1(E)
NetD7_3: D7.3(K) L4.2 Q4.3(C)
NetD10_2: D10.2(A) D13.1(K)
NetD14_1: D14.1 Q9.2(E)
NetD14_2: D14.2 R93.1
NetD15_1: D15.1 Q10.2(E)
NetD15_2: D15.2 R95.1
NetD16_2: D16.2(K) U14.4
NetD17_1: D17.1 U30.9(Q) U32.11(C)
NetD17_2: D17.2 U39.3
NetD17_3: D17.3 R254.2
NetD18_2: D18.2(K) U14.2 U15.4
NetD22_1: D22.1(A) D22.3(A) R313.2
NetD30_3: D30.3 U32.5(Q)
NetD31_3: D31.3 U32.9(Q)
NetD38_1: D38.1(K) R232.2
NetD38_2: D38.2(A) Q21.3(C)
NetD41_1: D41.1(K) R260.1 R266.2 R271.2 U50.2(VDD)
NetD42_1: D42.1 D42.2 D43.1 D43.2 R287.1 U52.2
NetD42_3: D42.3 U5.4
NetD43_3: D43.3 U5.2
NetD44_2: D44.2(A) D45.1
NetD45_2: D45.2 D48.2(A)
NetD46_2: D46.2 R286.1
NetD49_1: D49.1 D50.2(A)
NetD49_2: D49.2 D51.2(A)
NetD60_3: D60.3 U6.9(P57)
NetF1_2: F1.2 J6.1(Pin_1)
NetJ5_17: J5.17(Pin_17) U54.2(D) U54.6(~{{Q}})
NetL15_2: L15.2(-) Q20.3(C) R239.1 R240.1
NetQ5_2: Q5.2(B) R111.1
NetQ7_1: Q7.1(B) R87.1
NetQ9_1: Q9.1(B) R107.1
NetQ9_3: Q9.3(C) R99.1
NetQ10_1: Q10.1(B) R97.1
NetQ10_3: Q10.3(C) R100.1
NetQ11_1: Q11.1(B) R93.2 R99.2
NetQ12_1: Q12.1(B) R85.2
NetQ13_1: Q13.1(B) R95.2 R100.2
NetQ15_3: Q15.3(C) R111.2
NetQ17_3: Q17.3(B) U6.39(P17)
NetQ20_1: Q20.1(B) R232.1
NetQ21_1: Q21.1(B) Q23.1(B) R237.2
NetQ22_2: Q22.2(B) Q23.3(C) R240.2
NetQ22_3: Q22.3(C) R239.2
NetQ26_1: Q26.1(B) R254.1
NetQ27_1: Q27.1(B) R262.2
NetQ28_1: Q28.1(B) R260.2 U50.1(OUT)
NetQ39_2: Q39.2(C) R388.2
NetQ40_2: Q40.2(C) R386.2
NetR38_1: R38.1 U6.19(P45)
NetR39_1: R39.1 U6.15(P51)
NetR40_1: R40.1 U6.29(Xout)
NetR42_2: R42.2 U6.24(P40)
NetR43_1: R43.1 R62.1 U6.79(VL2)
NetR43_2: R43.2 R63.2 U6.80(VL1)
NetR52_1: R52.1 R62.2 U6.78(VL3)
NetR83_1: R83.1 U13.1(OUT) U15.2
NetR86_2: R86.2 U6.40(P16)
NetR89_2: R89.2 U6.36(P22)
NetR146_1: R146.1 U30.6(~{{Q}})
NetR167_2: R167.2 U6.45(P11)
NetR207_1: R207.1 R210.1 U44.3(+)
NetR208_1: R208.1 R209.1 U44.5(+)
NetR268_2: R268.2 U52.4
NetR277_1: R277.1 R280.1 SW1.2(B)
NetR278_1: R278.1 U5.9 U55.1(OUT)
NetR283_1: R283.1 U6.35(P23)
NetR286_2: R286.2 U54.9(Q)
NetR328_1: R328.1 U6.50(P04)
NetR330_2: R330.2 U6.47(SEG07)
NetR331_2: R331.2 U6.54(SEG00)
NetR336_1: R336.1 U6.52(P02)
NetR339_2: R339.2 U6.51(P03)
NetR351_1: R351.1 U6.53(SEG01)
NetR354_1: R354.1 U6.49(P05)
NetR355_1: R355.1 U6.48(P06)
NetR390_2: R390.2 U6.43(P13)
NetR407_1: R407.1 U6.44(P12)
NetR413_2: R413.2 U6.46(P10)
NetU5_8: U5.8 U54.11(C)
NetU5_10: U5.10 U54.3(C)
NetU5_12: U5.12 U30.11(C)
NetU29_1: U29.1 U30.8(~{{Q}})
NetU29_2: U29.2 U32.6(~{{Q}})

Not connected (* = marked no-connect by the designer): D4 1*; D6 1(NC); D7 1(NC); D10 3(common)*; D13 3(common)*; J5 6(Pin_6)*; Q28 3(C)*; U6 10(P56)* 12(P54)* 17(P47)* 22(P42)* 32(P26)* 33(P25)* 34(P24)* 59(SEG11)* 60(SEG10)*; U13 4(NC); U14 1(NC); U15 1(NC); U30 5(Q)*; U32 4(~{{S}})* 8(~{{Q}})*; U50 4(NC) 5(NC); U52 1(NC); U53 4(NC); U54 8(~{{Q}})*; U55 4(NC) 5(NC)

## Notes on the sheet
- YellowWire2_1
- YellowWire1
- (near D6) 10.5v
- (near J5) YellowWire2_3
- 5v
- (near Q15) YellowWire1
- 5v switched on via PWRGD
- U103_NAND_of_U53_1CLK_and_U53_1Q#
- 1
- 2
- 3
- 4
- 5
- 6
- 7
- 8
- 9
- 10
- 11
- 12
- 13
- 14
- 15
- 16
- A
- B
- C
- D
- E
- F
- G
- H
- I
- J
- K
- Title: PC110
- File: Power.kicad_sch
- Sheet: /
- Recreated by: Ahmad Byagowi
- KiCad E.D.A.  kicad (5.1.4)-1
- Size: A1
- Date:
- Rev:
- Id: 1/1

## Library data of the parts
C27-C29 C33 C46 C47 C49 C51 C55 C58 C60 C61 C63 C65 C67 C96 C98 C99 C118 C137-C139 C179 C190 C216-C226 C228 C229 C231 C233 C234 C245 = C
  C27 C28: Value: 18pF; Footprint: Capacitor_SMD:C_0402_1005Metric
  C29: Value: 120nF; Footprint: Capacitor_SMD:C_0402_1005Metric
  C33 C65 C96 C216 C217 C219 C220 C223 C231 C234: Value: 150nF; Footprint: Capacitor_SMD:C_0402_1005Metric
  C46 C190 C222 C224 C245: Value: 10nF; Footprint: Capacitor_SMD:C_0603_1608Metric
  C47: Value: 5.6uF; Footprint: Capacitor_SMD:C_1206_3216Metric
  C49: Value: 2.2uF; Footprint: Capacitor_SMD:C_0805_2012Metric
  C51: Value: 10uF; Footprint: Capacitor_SMD:C_1206_3216Metric
  C55 C58 C67 C139: Value: 100nF; Footprint: Capacitor_SMD:C_0402_1005Metric
  C60 C63: Value: 100nF; Footprint: Capacitor_SMD:C_0603_1608Metric
  C61: Value: 180nF; Footprint: Capacitor_SMD:C_0402_1005Metric
  C98: Value: 330pF; Footprint: Capacitor_SMD:C_0402_1005Metric
  C99 C228: Value: 100pF; Footprint: Capacitor_SMD:C_0402_1005Metric
  C118: Value: 2.7uF; Footprint: Capacitor_SMD:C_0805_2012Metric
  C137 C138 C179: Value: 1nF; Footprint: Capacitor_SMD:C_0402_1005Metric
  C218 C221: Value: 150nF; Footprint: Capacitor_SMD:C_0603_1608Metric
  C225 C226 C229: Value: 1uF; Footprint: Capacitor_SMD:C_0603_1608Metric
  C233: Value: 330nF; Footprint: Capacitor_SMD:C_0603_1608Metric
D4 D14 D15 D17 D30 D31 D37 D42 D43 D45 D46 D49 D60 = 3D_Diode
  D4 D14 D15 D17 D30 D31 D37 D42 D43 D45 D46 D49: Value: N; Footprint: PC110:SOT-416L
  D60: Value: 3D; Footprint: Package_TO_SOT_SMD:SOT-23
D6 D7 = D_Schottky_Generic_xAK: Value: Q; Footprint: PC110:3D
D8 D16 D18 D22 = D_Schottky_Dual_CommonCathode_AKA: Footprint: PC110:3D
  D8: Value: DNP
  D16 D18 D22: Value: 3D
D10 D13 = D_Dual_Series_KAC: Value: K; Footprint: PC110:SOT-416L
D11 = D_Dual_CommonCathode_AKA: Value: DNP; Footprint: PC110:3D
D38 D41 D44 D47 D48 D50 D51 = D_Zener_Small_Filled: Footprint: Diode_SMD:D_0603_1608Metric
  D38: Value: 40
  D41 D47: Value: 24
  D44: Value: 83
  D48: Value: A2
  D50: Value: 26
  D51: Value: C6
F1 = Fuse: Value: 0.5A; Footprint: Fuse:Fuse_1206_3216Metric
J5 = Conn_02x20_Counter_Clockwise: Value: PSU_Connector; Footprint: PC110:PSU_Connector
J6 = Conn_01x02: Value: BridgeBatt; Footprint: PC110:BridgeBatt
J18 = Conn_01x04: Value: Flat-4; Footprint: PC110:Flat-4
L4 = L_Ferrite: Value: 68uH; Footprint: PCM_Inductor_SMD_AKL:L_1210_3225Metric
L15 = L: Value: 1.5uH; Footprint: Inductor_SMD:L_0603_1608Metric
Q3 = MCP1700x-120xxTO: Value: 582 B74; Footprint: Package_TO_SOT_SMD:SOT-89-3
Q4 Q22 = Q_NPN_Generic_EBC: Value: YQ; Footprint: PC110:SOT-416L
Q5 = Q_PNP_Generic_EBC: Value: HQ; Footprint: PC110:SOT-416L
Q7 Q9 Q10 Q12 Q26 Q27 = MMBTA44: Value: 8C
  Q7 Q10 Q12 Q26 Q27: Footprint: Package_TO_SOT_SMD:SOT-416
  Q9: Footprint: Package_TO_SOT_SMD:SOT-523
Q11 Q13 = MMBTA56: Value: IS6; Footprint: PCM_Package_TO_SOT_SMD_AKL:SOT-23
Q15 Q21 Q23 Q28 = Q_NPN_Generic_BEC: Footprint: Package_TO_SOT_SMD:SOT-416
  Q15 Q21 Q23: Value: 8B
  Q28: Value: 8LR
Q17 Q39 Q40 = Q_PNP_Generic_ECB
  Q17: Value: 6D; Footprint: PC110:3D
  Q39 Q40: Value: HQ; Footprint: PC110:TSOT-23
Q20 = Q_PNP_Generic_BEC: Value: 7C; Footprint: Package_TO_SOT_SMD:TSOT-23
Q29 = D_Zener_Dual_CommonAnode_KKA: Value: DNP; Footprint: PCM_Package_TO_SOT_SMD_AKL:SOT-23
Q30 Q41 Q42 = Q_NPN_Generic_ECB
  Q30: Value: 8C; Footprint: Package_TO_SOT_SMD:SOT-416
  Q41 Q42: Value: CQ; Footprint: PC110:TSOT-23
R38-R44 R52 R60 R62 R63 R68 R76 R80-R87 R89 R90 R93 R95 R97-R100 R107-R111 R128 R146 R152 R156 R167 R171 R207-R214 R232 R235 R237 R239 R240 R254 R260 R262 R266 R268 R271 R276-R278 R280-R283 R285-R288 R313 R328 R330 R331 R336 R339 R349 R351 R354-R356 R385 R386 R388 R390 R397 R407 R408 R411 R413 = R
  R38 R42 R86 R89 R98 R108 R283 R328 R330 R331 R336 R339 R351 R354 R355: Value: 4.7k; Footprint: PCM_Resistor_SMD_AKL:R_0402_1005Metric
  R39 R40 R85 R93 R95 R171 R240 R280 R288 R356: Value: 47k; Footprint: PCM_Resistor_SMD_AKL:R_0402_1005Metric
  R41 R97 R109 R110 R232 R237 R281: Value: 10k; Footprint: PCM_Resistor_SMD_AKL:R_0402_1005Metric
  R43 R62 R63: Value: 68k; Footprint: PCM_Resistor_SMD_AKL:R_0402_1005Metric
  R44 R81 R87 R167 R209 R212 R214 R268 R349: Value: 100k; Footprint: PCM_Resistor_SMD_AKL:R_0402_1005Metric
  R52 R207 R208 R211 R213: Value: 120k; Footprint: PCM_Resistor_SMD_AKL:R_0402_1005Metric
  R60 R266: Value: 50k; Footprint: PCM_Resistor_SMD_AKL:R_0402_1005Metric
  R68: Value: 56; Footprint: Resistor_SMD:R_0805_2012Metric
  R76: Value: 1k; Footprint: PCM_Resistor_SMD_AKL:R_0402_1005Metric
  R80 R82 R83 R90 R128 R146 R152 R156 R235 R262 R278 R282 R287: Value: 470k; Footprint: PCM_Resistor_SMD_AKL:R_0402_1005Metric
  R84 R285: Value: 0; Footprint: PCM_Resistor_SMD_AKL:R_0402_1005Metric
  R99: Value: 470; Footprint: PCM_Resistor_SMD_AKL:R_0402_1005Metric
  R100: Value: 220; Footprint: PCM_Resistor_SMD_AKL:R_0402_1005Metric
  R107 R276: Value: 33k; Footprint: PCM_Resistor_SMD_AKL:R_0402_1005Metric
  R111: Value: 100; Footprint: PCM_Resistor_SMD_AKL:R_0603_1608Metric
  R210: Value: 100K; Footprint: PCM_Resistor_SMD_AKL:R_0402_1005Metric
  R239: Value: 56; Footprint: PCM_Resistor_SMD_AKL:R_0603_1608Metric
  R254 R385 R397 R408 R411: Value: 47k; Footprint: Resistor_SMD:R_0402_1005Metric
  R260: Value: 133k; Footprint: PCM_Resistor_SMD_AKL:R_0402_1005Metric
  R271: Value: DNP; Footprint: PCM_Resistor_SMD_AKL:R_0402_1005Metric
  R277: Value: 200k; Footprint: PCM_Resistor_SMD_AKL:R_0402_1005Metric
  R286: Value: 22k; Footprint: PCM_Resistor_SMD_AKL:R_0402_1005Metric
  R313: Value: 300; Footprint: Resistor_SMD:R_0805_2012Metric
  R386: Value: 1k; Footprint: Resistor_SMD:R_0402_1005Metric
  R388: Value: 3K; Footprint: Resistor_SMD:R_0402_1005Metric
  R390 R407 R413: Value: 100k; Footprint: Resistor_SMD:R_0402_1005Metric
SW1 = SW_SPST: Value: Switch; Footprint: PC110:Switch
U5 = 74LS14: Value: 74HC14; Footprint: Package_SO:TSSOP-14_4.4x5mm_P0.65mm
U13 U53 = QC01
  U13: Value: 8C01; Footprint: Package_TO_SOT_SMD:SOT-23-5
  U53: Value: 3F01; Footprint: Package_SO:TSOP-5_1.65x3.05mm_P0.95mm
U14 U15 U52 = 74AHC1G14: Value: EA; Footprint: PC110:SOT-353
U20 = 74LVC3G14: Value: 7W14; Footprint: PC110:sso-8
U29 = SN74LVC1G00DBV: Value: E2; Footprint: PC110:SOT-353
U30 U32 = 74LS74: Footprint: Package_SO:TSSOP-14_4.4x5mm_P0.65mm
  U30: Value: 74LVT74
  U32: Value: V74
U39 = 74AHC2G00: Value: 7W00; Footprint: PC110:sso-8
U43 = Conn_01x14: Value: Front LCD; Footprint: PC110:LCD
U44 = LM2904: Value: NJM2904M; Footprint: PC110:soic-8-small
U54 = 74HC74: Value: SN74HC74; Footprint: Package_SO:TSSOP-14_4.4x5mm_P0.65mm
X1 = X-crystal: Value: 245759; Footprint: PC110:XTAL-2
U6 = M38223E4HP: Value: M38223E4HP; Footprint: PC110:QFN-80
U50 U55 = 3T01: Value: 3T01
  U50: Footprint: Package_TO_SOT_SMD:SOT-23-5
  U55: Footprint: Package_SO:TSOP-5_1.65x3.05mm_P0.95mm